# Altium schematic sheet 02_电源部分.SchDoc
size A4; DocumentNumber: 2; SheetNumber: 2; SheetTotal: 4
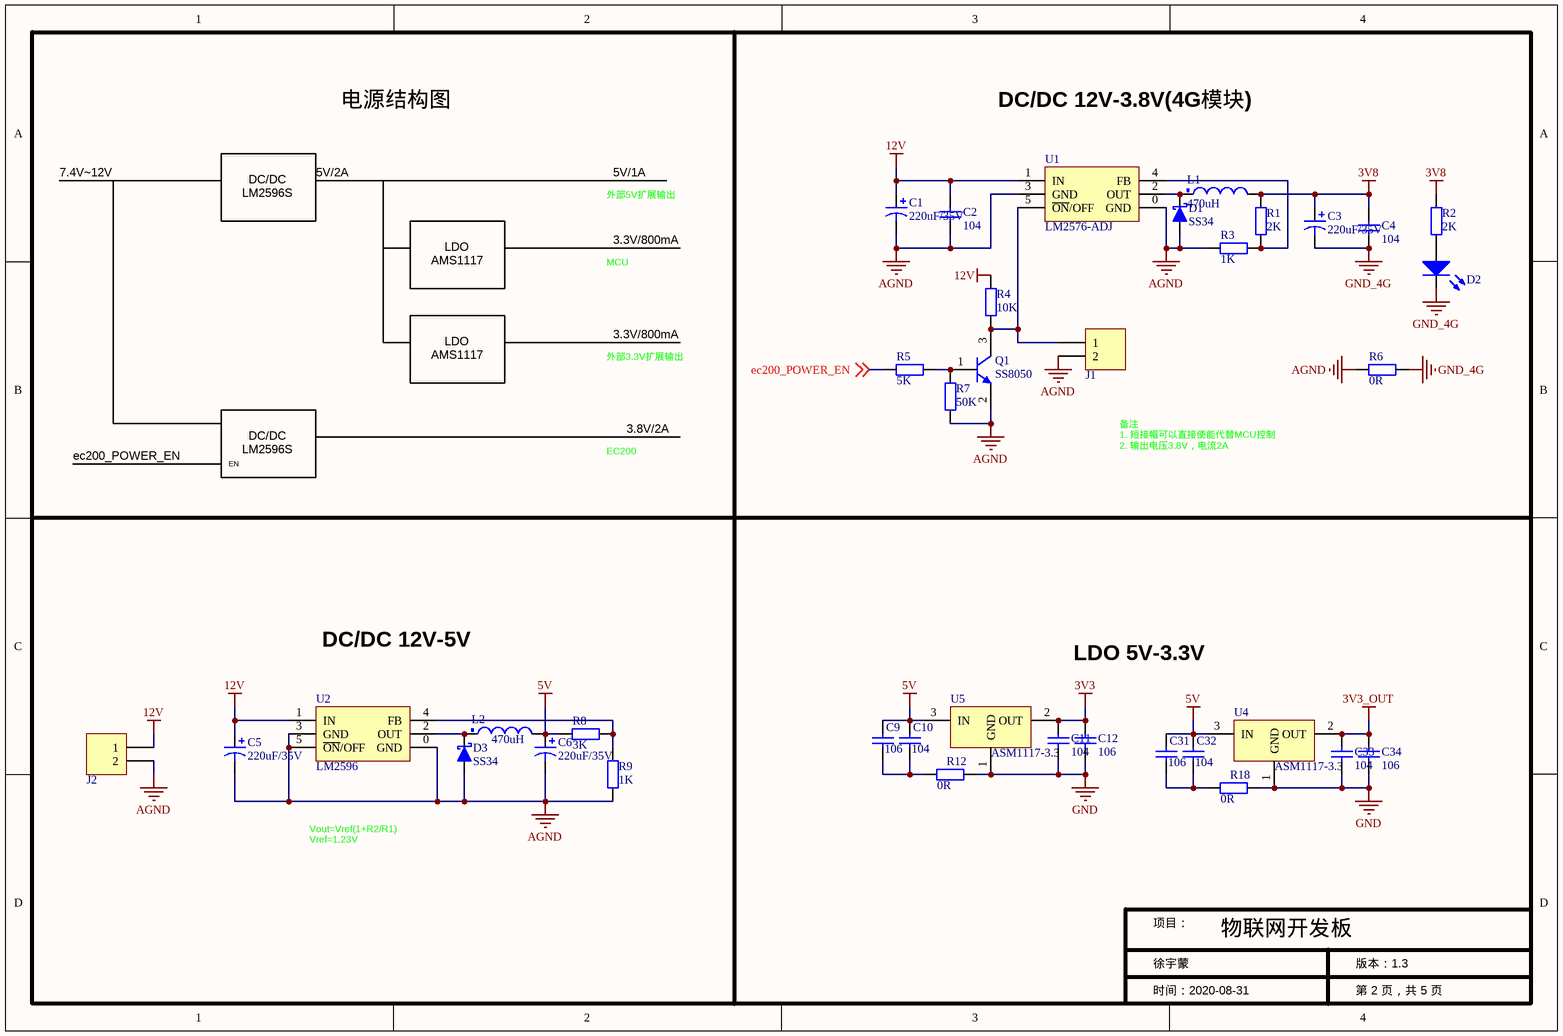
[diagram p0: 02_电源部分.SchDoc]

## Parts
C1  value 220uF/35V  [Cap8x10.5mm]  (hidden comment: Cap Pol)
C2  value 104  [CAP-0603]  (hidden comment: Cap)
C3  value 220uF/35V  [Cap8x10.5mm]  (hidden comment: Cap Pol)
C4  value 104  [CAP-0603]  (hidden comment: Cap)
C5  value 220uF/35V  [Cap8x10.5mm]  (hidden comment: Cap Pol)
C6  value 220uF/35V  [Cap8x10.5mm]  (hidden comment: Cap Pol)
C9  value 106  [CAP-0603]  (hidden comment: Cap)
C10  value 104  [CAP-0603]  (hidden comment: Cap)
C11  value 104  [CAP-0603]  (hidden comment: Cap)
C12  value 106  [CAP-0603]  (hidden comment: Cap)
C31  value 106  [CAP-0603]  (hidden comment: Cap)
C32  value 104  [CAP-0603]  (hidden comment: Cap)
C33  value 104  [CAP-0603]  (hidden comment: Cap)
C34  value 106  [CAP-0603]  (hidden comment: Cap)
D1  SS34  [SMA(DO-214AC)]
D2  LED  [LED_0805]  (value not drawn)
D3  SS34  [SMA(DO-214AC)]
J1  Header 2  [Header_2X1_2.54]  (value not drawn)
J2  Header 2  [Header_HT_2P_5.08_Right]  (value not drawn)
L1  value 470uH  [CD43]  (hidden comment: Inductor)
L2  value 470uH  [CD43]  (hidden comment: Inductor)
Q1  SS8050  [SOT-23]
R1  value 2K  [0603]  (hidden comment: Res)
R2  value 2K  [0603]  (hidden comment: Res)
R3  value 1K  [0603]  (hidden comment: Res)
R4  value 10K  [0603]  (hidden comment: Res)
R5  value 5K  [0603]  (hidden comment: Res)
R6  value 0R  [0805]  (hidden comment: Res)
R7  value 50K  [0603]  (hidden comment: Res)
R8  value 3K  [0603]  (hidden comment: Res)
R9  value 1K  [0603]  (hidden comment: Res)
R12  value 0R  [0805]  (hidden comment: Res)
R18  value 0R  [0805]  (hidden comment: Res)
U1  LM2576-ADJ  [TO-263-5 无背面散热]
U2  LM2596  [TO-263-5 无背面散热]
U4  ASM1117-3.3  [SOT-223]
U5  ASM1117-3.3  [SOT-223]

## Nets
3V3: C11.2 C12.2 U5.2(OUT)
3V3_OUT: C33.2 C34.2 U4.2(OUT)
3V8: C3.1 C4.2 L1.2 R1.1 R2.2
5V: C6.1 C9.2 C10.2 C31.2 C32.2 L2.2 R8.1 U4.3(IN) U5.3(IN)
12V: C1.1 C2.2 C5.1 J2.1 R4.1 U1.1(IN) U2.1(IN)
AGND: C1.2 C2.1 C5.2 C6.2 D1.1(A) D3.1(A) J1.2 J2.2 Q1.2(E) R3.1 R6.1 R7.2 R9.1 U1.0(GND) U1.3(GND) U2.0(GND) U2.3(GND) U2.5(~{ON}/OFF)
GND: C11.1 C12.1 C33.1 C34.1 R12.2 R18.2 U4.1(GND) U5.1(GND)
GND_4G: C3.2 C4.1 D2.2(K) R6.2
ec200_POWER_EN: R5.1 ; off-sheet ec200_POWER_EN
NetC9_1: C9.1 C10.1 R12.1
NetC31_1: C31.1 C32.1 R18.1
NetD1_2: D1.2(K) L1.1 U1.2(OUT)
NetD2_1: D2.1(A) R2.1
NetD3_2: D3.2(K) L2.1 U2.2(OUT)
NetJ1_1: J1.1 Q1.3(C) R4.2 U1.5(~{ON}/OFF)
NetQ1_1: Q1.1(B) R5.2 R7.1
NetR1_2: R1.2 R3.2 U1.4(FB)
NetR8_2: R8.2 R9.2 U2.4(FB)

## Notes on the sheet
- 电源结构图
- DC/DC 12V-3.8V(4G模块)
- 7.4V~12V
- 5V/2A
- 5V/1A
- LM2596S
- DC/DC
- LDO
- 外部5V扩展输出
- 3.3V/800mA
- AMS1117
- MCU
- 外部3.3V扩展输出
- 3.8V/2A
- ec200_POWER_EN
- EN
- EC200
- 备注
  1. 短接帽可以直接使能代替MCU控制
  2. 输出电压3.8V，电流2A
- DC/DC 12V-5V
- LDO 5V-3.3V
- Vout=Vref(1+R2/R1)
  Vref=1.23V
- 项目：
- 物联网开发板
- 徐宇蒙
- 时间：2020-08-31
- 第 2 页，共 5 页
- 版本：1.3

## Library data of the parts
C1 C3 C5 C6 = Cap Pol: 贴片电解电容 8*10.5mm; Published: 8-Jun-2000; LatestRevisionDate: 17-Jul-2002; LatestRevisionNote: Re-released for DXP Platform.; PackageReference: POLAR0.8; Publisher: Altium Limited
C2 C4 C9-C12 C31-C34 = Cap: 无极性电容; Published: 8-Jun-2000; LatestRevisionDate: 17-Jul-2002; LatestRevisionNote: Re-released for DXP Platform.; PackageReference: RAD-0.3; Publisher: Altium Limited
D1 D3 = D Schottky: Schottky Diode; Published: 8-Jun-2000; LatestRevisionDate: 17-Jul-2002; LatestRevisionNote: Re-released for DXP Platform.; PackageReference: SMB; Publisher: Altium Limited; Code_JEDEC: DO-214-AA
D2 = LED: 发光二极管; Published: 8-Jun-2000; LatestRevisionDate: 08-Jul-2005; LatestRevisionNote: Mech Layer 1 removed.; PackageReference: LED-0; Publisher: Altium Limited
J1 J2 = Header 2: 接插件; LatestRevisionDate: 17-Jul-2002; LatestRevisionNote: Re-released for DXP Platform.; Publisher: Altium Limited
L1 L2 = Inductor: 贴片功率电感; Code_IEC: 1005; Published: 8-Jun-2000; LatestRevisionDate: 17-Jul-2002; LatestRevisionNote: Re-released for DXP Platform.; PackageReference: 0402-A; Publisher: Altium Limited; Code_JEITA: 0402
Q1 = SS8050: NPN贴片三极管; Published: 8-Jun-2000; LatestRevisionDate: 15-Jan-2003; LatestRevisionNote: PCB Footprint 'BCY-W3/D4.7' replaced; DatasheetDocument: 1997; PackageDocument: Sep-1998; PackageReference: TO-92A; Publisher: Altium Limited; Code_JEDEC: TO-92A; ComponentLink1Description: Manufacturer Link; ComponentLink1URL: http://www.fairchildsemi.com/; ComponentLink2Description: Datasheet; ComponentLink2URL: http://www.fairchildsemi.com/ds/2N%2F2N3904.pdf
R1-R9 R12 R18 = Res: 贴片电阻; Published: 8-Jun-2000; LatestRevisionDate: 17-Jul-2002; LatestRevisionNote: Re-released for DXP Platform.; PackageReference: AXIAL-0.4; Publisher: Altium Limited
U1 = LM2576
U2 = LM2596: DC/DC
U4 U5 = ASM1117: 3.3V稳压芯片